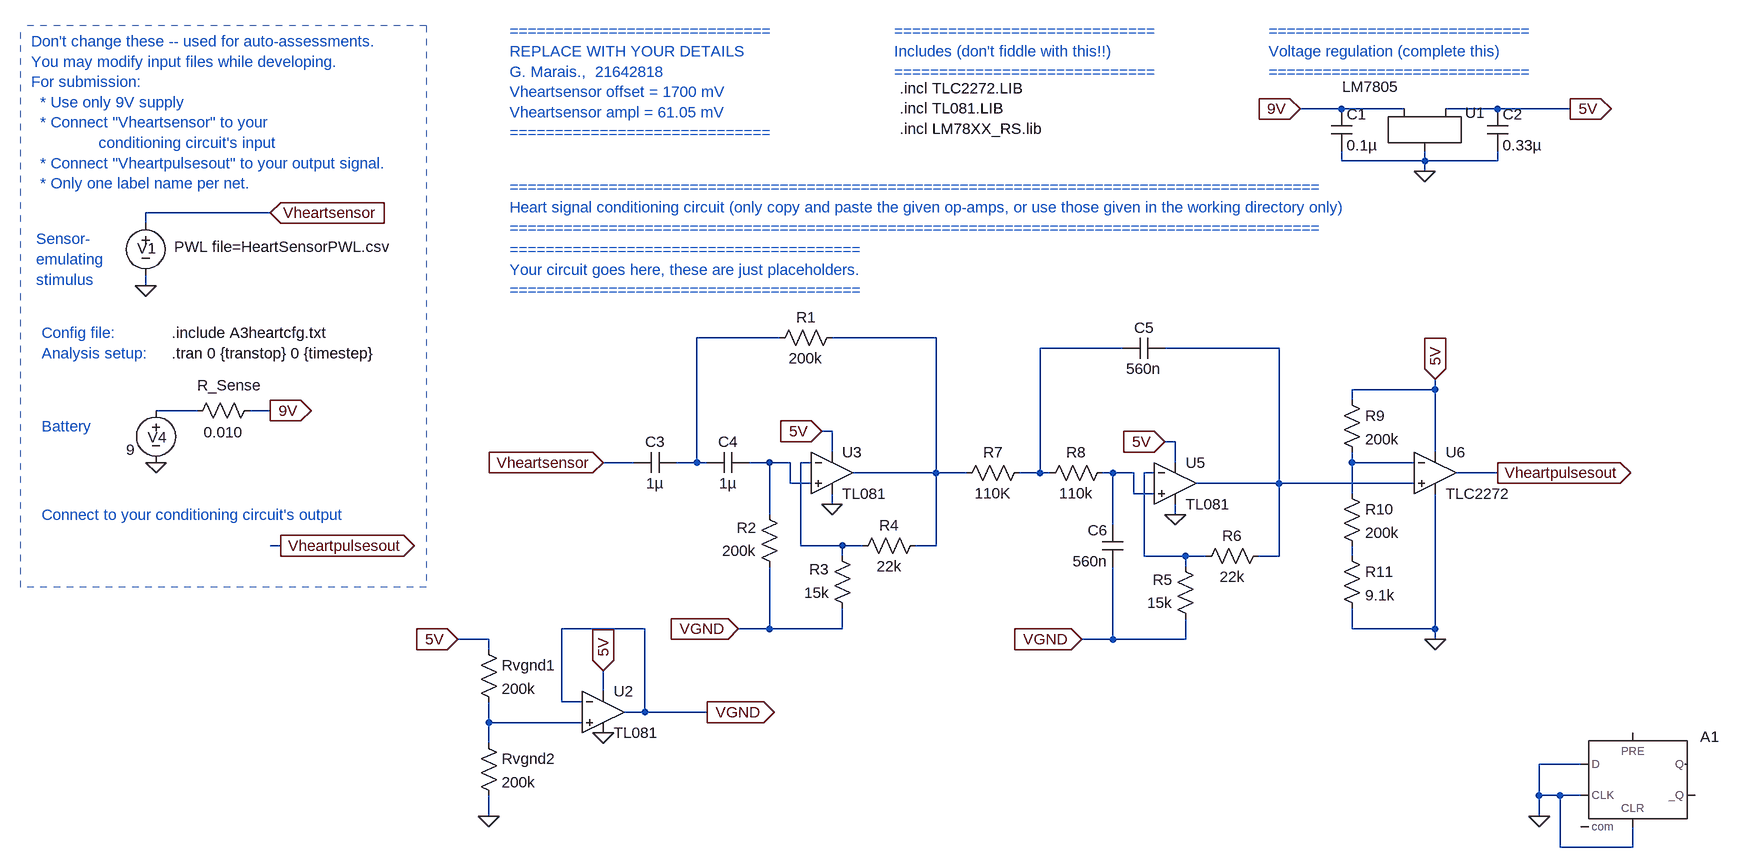
[diagram p0: schematic E344_A3_heart.asc]
E344_A3_heart.asc, the LTspice schematic file:
Version 4
SHEET 1 1824 680
WIRE -272 -1280 -336 -1280
WIRE -176 -1280 -272 -1280
WIRE -32 -1280 -112 -1280
WIRE 80 -1280 -32 -1280
WIRE -272 -1200 -272 -1216
WIRE -144 -1200 -144 -1216
WIRE -144 -1200 -272 -1200
WIRE -32 -1200 -32 -1216
WIRE -32 -1200 -144 -1200
WIRE -144 -1184 -144 -1200
WIRE -1920 -1120 -2112 -1120
WIRE -2112 -1104 -2112 -1120
WIRE -2112 -1008 -2112 -1024
WIRE -1136 -928 -1264 -928
WIRE -896 -928 -1056 -928
WIRE -608 -912 -736 -912
WIRE -368 -912 -544 -912
WIRE -128 -848 -128 -864
WIRE -128 -848 -256 -848
WIRE -256 -832 -256 -848
WIRE -2032 -816 -2096 -816
WIRE -1920 -816 -1952 -816
WIRE -1056 -784 -1072 -784
WIRE -528 -768 -544 -768
WIRE -1056 -752 -1056 -784
WIRE -128 -752 -128 -848
WIRE -1360 -736 -1408 -736
WIRE -1264 -736 -1264 -928
WIRE -1264 -736 -1296 -736
WIRE -1248 -736 -1264 -736
WIRE -1152 -736 -1184 -736
WIRE -1120 -736 -1152 -736
WIRE -1088 -736 -1104 -736
WIRE -528 -736 -528 -768
WIRE -256 -736 -256 -752
WIRE -160 -736 -256 -736
WIRE -896 -720 -896 -928
WIRE -896 -720 -1024 -720
WIRE -848 -720 -896 -720
WIRE -736 -720 -736 -912
WIRE -736 -720 -768 -720
WIRE -720 -720 -736 -720
WIRE -624 -720 -640 -720
WIRE -592 -720 -624 -720
WIRE -560 -720 -576 -720
WIRE -32 -720 -96 -720
WIRE -1120 -704 -1120 -736
WIRE -1088 -704 -1120 -704
WIRE -368 -704 -368 -912
WIRE -368 -704 -496 -704
WIRE -160 -704 -368 -704
WIRE -592 -688 -592 -720
WIRE -560 -688 -592 -688
WIRE -256 -688 -256 -736
WIRE -1056 -672 -1056 -688
WIRE -1152 -656 -1152 -736
WIRE -528 -656 -528 -672
WIRE -624 -640 -624 -720
WIRE -1904 -608 -1920 -608
WIRE -1104 -608 -1104 -736
WIRE -1040 -608 -1104 -608
WIRE -1008 -608 -1040 -608
WIRE -896 -608 -896 -720
WIRE -896 -608 -928 -608
WIRE -1040 -592 -1040 -608
WIRE -576 -592 -576 -720
WIRE -512 -592 -576 -592
WIRE -480 -592 -512 -592
WIRE -368 -592 -368 -704
WIRE -368 -592 -400 -592
WIRE -256 -592 -256 -608
WIRE -512 -576 -512 -592
WIRE -1344 -480 -1472 -480
WIRE -1152 -480 -1152 -576
WIRE -1152 -480 -1200 -480
WIRE -1040 -480 -1040 -512
WIRE -1040 -480 -1152 -480
WIRE -256 -480 -256 -512
WIRE -128 -480 -128 -688
WIRE -128 -480 -256 -480
WIRE -1584 -464 -1632 -464
WIRE -624 -464 -624 -576
WIRE -624 -464 -672 -464
WIRE -512 -464 -512 -496
WIRE -512 -464 -624 -464
WIRE -128 -464 -128 -480
WIRE -1584 -448 -1584 -464
WIRE -1408 -384 -1408 -416
WIRE -1472 -368 -1472 -480
WIRE -1440 -368 -1472 -368
WIRE -1344 -352 -1344 -480
WIRE -1344 -352 -1376 -352
WIRE -1248 -352 -1344 -352
WIRE -1584 -336 -1584 -368
WIRE -1440 -336 -1584 -336
WIRE -1584 -304 -1584 -336
WIRE 96 -272 32 -272
WIRE 32 -224 32 -272
WIRE 64 -224 32 -224
WIRE 96 -224 64 -224
WIRE -1584 -192 -1584 -224
WIRE 32 -192 32 -224
WIRE 64 -144 64 -224
WIRE 176 -144 176 -176
WIRE 176 -144 64 -144
FLAG -2112 -1008 0
FLAG -1920 -1120 Vheartsensor
IOPIN -1920 -1120 In
FLAG -1920 -816 9V
IOPIN -1920 -816 Out
FLAG -2096 -736 0
FLAG -336 -1280 9V
IOPIN -336 -1280 In
FLAG -144 -1184 0
FLAG 80 -1280 5V
IOPIN 80 -1280 Out
FLAG -1904 -608 Vheartpulsesout
IOPIN -1904 -608 Out
FLAG -1408 -736 Vheartsensor
IOPIN -1408 -736 In
FLAG -32 -720 Vheartpulsesout
IOPIN -32 -720 Out
FLAG 32 -192 0
FLAG -1248 -352 VGND
IOPIN -1248 -352 Out
FLAG -1584 -192 0
FLAG -1632 -464 5V
IOPIN -1632 -464 In
FLAG -1408 -320 0
FLAG -1408 -416 5V
IOPIN -1408 -416 In
FLAG -1056 -672 0
FLAG -1072 -784 5V
IOPIN -1072 -784 In
FLAG -1200 -480 VGND
IOPIN -1200 -480 In
FLAG -528 -656 0
FLAG -544 -768 5V
IOPIN -544 -768 In
FLAG -672 -464 VGND
IOPIN -672 -464 In
FLAG -128 -864 5V
IOPIN -128 -864 In
FLAG -128 -464 0
SYMBOL voltage -2112 -1120 R0
WINDOW 123 0 0 Left 0
WINDOW 39 0 0 Left 0
WINDOW 3 44 52 Left 2
WINDOW 0 -13 54 Left 2
SYMATTR Value PWL file=HeartSensorPWL.csv
SYMATTR InstName V1
SYMBOL voltage -2096 -832 R0
WINDOW 123 24 44 Left 2
WINDOW 39 0 0 Left 0
WINDOW 3 -46 76 Left 2
WINDOW 0 -13 57 Left 2
SYMATTR Value 9
SYMATTR InstName V4
SYMBOL res -1936 -832 R90
WINDOW 0 -7 47 VBottom 2
WINDOW 3 34 56 VTop 2
SYMATTR InstName R_Sense
SYMATTR Value 0.010
SYMBOL LM7805 -144 -1264 R0
WINDOW 3 -83 -66 Top 2
SYMATTR InstName U1
SYMBOL dflop 176 -320 R0
SYMATTR InstName A1
SYMBOL cap -288 -1280 R0
SYMATTR InstName C1
SYMATTR Value 0.1µ
SYMBOL cap -48 -1280 R0
SYMATTR InstName C2
SYMATTR Value 0.33µ
SYMBOL res -1600 -464 R0
SYMATTR InstName Rvgnd1
SYMATTR Value 200k
SYMBOL res -1600 -320 R0
SYMATTR InstName Rvgnd2
SYMATTR Value 200k
SYMBOL Opamps\\opamp2 -1408 -416 R0
SYMATTR InstName U2
SYMATTR Value TL081
SYMBOL cap -1296 -752 R90
WINDOW 0 0 32 VBottom 2
WINDOW 3 32 32 VTop 2
SYMATTR InstName C3
SYMATTR Value 1µ
SYMBOL cap -1184 -752 R90
WINDOW 0 0 32 VBottom 2
WINDOW 3 32 32 VTop 2
SYMATTR InstName C4
SYMATTR Value 1µ
SYMBOL res -1040 -944 R90
WINDOW 0 0 56 VBottom 2
WINDOW 3 32 56 VTop 2
SYMATTR InstName R1
SYMATTR Value 200k
SYMBOL res -1136 -560 R180
WINDOW 0 36 76 Left 2
WINDOW 3 36 40 Left 2
SYMATTR InstName R2
SYMATTR Value 200k
SYMBOL res -1024 -496 R180
WINDOW 0 36 76 Left 2
WINDOW 3 36 40 Left 2
SYMATTR InstName R3
SYMATTR Value 15k
SYMBOL res -912 -624 R90
WINDOW 0 0 56 VBottom 2
WINDOW 3 32 56 VTop 2
SYMATTR InstName R4
SYMATTR Value 22k
SYMBOL Opamps\\opamp2 -1056 -784 R0
SYMATTR InstName U3
SYMATTR Value TL081
SYMBOL res -496 -480 R180
WINDOW 0 36 76 Left 2
WINDOW 3 36 40 Left 2
SYMATTR InstName R5
SYMATTR Value 15k
SYMBOL res -384 -608 R90
WINDOW 0 0 56 VBottom 2
WINDOW 3 32 56 VTop 2
SYMATTR InstName R6
SYMATTR Value 22k
SYMBOL Opamps\\opamp2 -528 -768 R0
SYMATTR InstName U5
SYMATTR Value TL081
SYMBOL res -752 -736 R90
WINDOW 0 0 56 VBottom 2
WINDOW 3 32 56 VTop 2
SYMATTR InstName R7
SYMATTR Value 110K
SYMBOL res -624 -736 R90
WINDOW 0 0 56 VBottom 2
WINDOW 3 32 56 VTop 2
SYMATTR InstName R8
SYMATTR Value 110k
SYMBOL cap -544 -928 R90
WINDOW 0 0 32 VBottom 2
WINDOW 3 32 32 VTop 2
SYMATTR InstName C5
SYMATTR Value 560n
SYMBOL cap -608 -576 R180
WINDOW 0 24 56 Left 2
WINDOW 3 24 8 Left 2
SYMATTR InstName C6
SYMATTR Value 560n
SYMBOL Opamps\\opamp2 -128 -784 R0
SYMATTR InstName U6
SYMATTR Value TLC2272
SYMBOL res -272 -848 R0
SYMATTR InstName R9
SYMATTR Value 200k
SYMBOL res -272 -704 R0
SYMATTR InstName R10
SYMATTR Value 200k
SYMBOL res -272 -608 R0
SYMATTR InstName R11
SYMATTR Value 9.1k
TEXT -2072 -904 Left 2 !.tran 0 {transtop} 0 {timestep}
TEXT -2072 -936 Left 2 !.include A3heartcfg.txt
TEXT -2288 -1384 Left 2 ;Don't change these -- used for auto-assessments.\nYou may modify input files while developing.\nFor submission: \n  * Use only 9V supply \n  * Connect "Vheartsensor" to your \n               conditioning circuit's input\n  * Connect "Vheartpulsesout" to your output signal.\n  * Only one label name per net.
TEXT -2272 -936 Left 2 ;Config file:
TEXT -2272 -904 Left 2 ;Analysis setup:
TEXT -2272 -792 Left 2 ;Battery
TEXT -2280 -1080 Left 2 ;Sensor-\nemulating \nstimulus
TEXT -1552 -1400 Left 2 ;=============================\nREPLACE WITH YOUR DETAILS\nG. Marais.,  21642818\nVheartsensor offset = 1700 mV\nVheartsensor ampl = 61.05 mV\n=============================
TEXT -1552 -1160 Left 2 ;==========================================================================================\nHeart signal conditioning circuit (only copy and paste the given op-amps, or use those given in the working directory only)\n==========================================================================================
TEXT -384 -1400 Left 2 ;=============================\nVoltage regulation (complete this)\n=============================
TEXT -952 -1312 Left 2 !.incl TLC2272.LIB\n.incl TL081.LIB\n.incl LM78XX_RS.lib
TEXT -2272 -656 Left 2 ;Connect to your conditioning circuit's output
TEXT -960 -1400 Left 2 ;=============================\nIncludes (don't fiddle with this!!)\n=============================
TEXT -1552 -1064 Left 2 ;=======================================\nYour circuit goes here, these are just placeholders.\n=======================================
LINE Normal -2304 -544 -2304 -1408 1
LINE Normal -1680 -1408 -1680 -544 1
LINE Normal -1680 -544 -2304 -544 1
LINE Normal -1680 -1408 -2304 -1408 1

The netlist it stands for:
* E344_A3_heart.asc
V1 Vheartsensor 0 PWL file=HeartSensorPWL.csv
V4 N005 0 9
R_Sense 9V N005 0.010
XU1 9V 0 5V LM7805
A1 0 0 0 0 0 0 0 0 DFLOP
C1 9V 0 0.1µ
C2 5V 0 0.33µ
Rvgnd1 5V N012 200k
Rvgnd2 N012 0 200k
XU2 N012 VGND 5V 0 VGND TL081  ; pins In+ In- V+ V- OUT
C3 N001 Vheartsensor 1µ
C4 N006 N001 1µ
R1 N002 N001 200k
R2 VGND N006 200k
R3 VGND N007 15k
R4 N002 N007 22k
XU3 N006 N007 5V 0 N002 TL081  ; pins In+ In- V+ V- OUT
R5 VGND N010 15k
R6 N004 N010 22k
XU5 N009 N010 5V 0 N004 TL081  ; pins In+ In- V+ V- OUT
R7 N003 N002 110K
R8 N009 N003 110k
C5 N004 N003 560n
C6 VGND N009 560n
XU6 N004 N008 5V 0 Vheartpulsesout TLC2272  ; pins In+ In- V+ V- OUT
R9 5V N008 200k
R10 N008 N011 200k
R11 N011 0 9.1k
.tran 0 {transtop} 0 {timestep}
.include A3heartcfg.txt
* Don't change these -- used for auto-assessments.
* You may modify input files while developing.
* For submission:
*   * Use only 9V supply
*   * Connect "Vheartsensor" to your
*                conditioning circuit's input
*   * Connect "Vheartpulsesout" to your output signal.
*   * Only one label name per net.
* Config file:
* Analysis setup:
* Battery
* Sensor-
* emulating
* stimulus
* =============================
* REPLACE WITH YOUR DETAILS
* G. Marais.,  21642818
* Vheartsensor offset = 1700 mV
* Vheartsensor ampl = 61.05 mV
* =============================
* ==========================================================================================
* Heart signal conditioning circuit (only copy and paste the given op-amps, or use those given in the working directory only)
* ==========================================================================================
* =============================
* Voltage regulation (complete this)
* =============================
.incl TLC2272.LIB
.incl TL081.LIB
.incl LM78XX_RS.lib
* Connect to your conditioning circuit's output
* =============================
* Includes (don't fiddle with this!!)
* =============================
* =======================================
* Your circuit goes here, these are just placeholders.
* =======================================
.backanno
.end